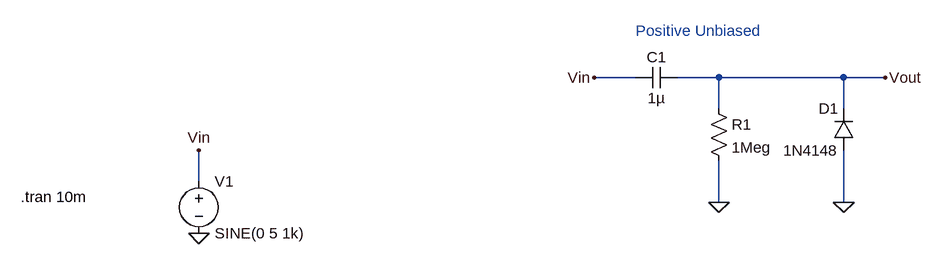
[diagram p0: schematic Diode Clamp.asc]
Diode Clamp.asc, the LTspice schematic file:
Version 4
SHEET 1 1332 680
WIRE 800 -32 736 -32
WIRE 928 -32 864 -32
WIRE 1120 -32 928 -32
WIRE 1184 -32 1120 -32
WIRE 928 16 928 -32
WIRE 1120 16 1120 -32
WIRE 128 128 128 80
WIRE 928 160 928 96
WIRE 1120 160 1120 80
FLAG 128 208 0
FLAG 128 80 Vin
FLAG 928 160 0
FLAG 1184 -32 Vout
FLAG 736 -32 Vin
FLAG 1120 160 0
SYMBOL voltage 128 112 R0
WINDOW 123 0 0 Left 0
WINDOW 39 0 0 Left 0
SYMATTR InstName V1
SYMATTR Value SINE(0 5 1k)
SYMBOL cap 864 -48 R90
WINDOW 0 0 32 VBottom 2
WINDOW 3 32 32 VTop 2
SYMATTR InstName C1
SYMATTR Value 1µ
SYMBOL diode 1136 80 R180
WINDOW 0 24 64 Left 2
WINDOW 3 24 0 Left 2
SYMATTR InstName D1
SYMATTR Value 1N4148
SYMBOL res 912 0 R0
SYMATTR InstName R1
SYMATTR Value 1Meg
TEXT 800 -104 Left 2 ;Positive Unbiased
TEXT -146 152 Left 2 !.tran 10m

The netlist it stands for:
* Diode Clamp.asc
V1 Vin 0 SINE(0 5 1k)
C1 Vout Vin 1µ
D1 0 Vout 1N4148
R1 Vout 0 1Meg
.model D D
.lib standard.dio
* Positive Unbiased
.tran 10m
.backanno
.end